# EAGLE schematic EnhancedMorseDecoder_Board (EAGLE 5.11)
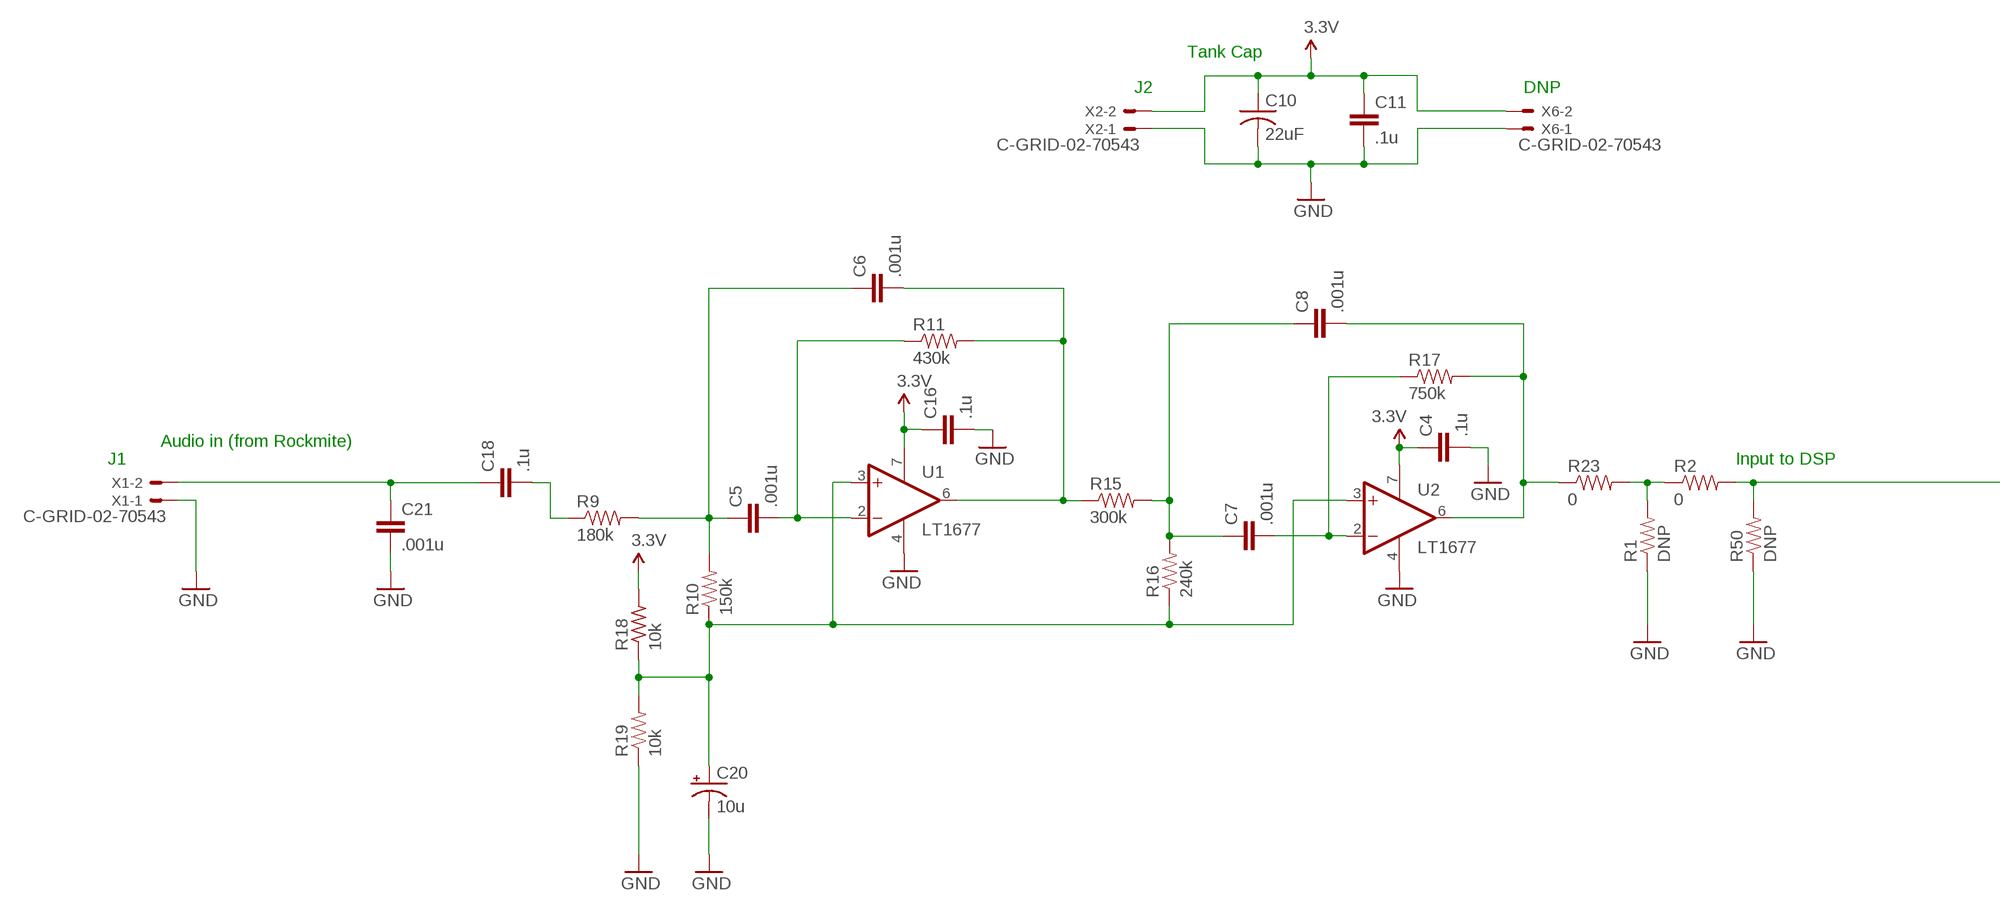
[diagram p0: schematic, sheet 1, part 1 of 2]
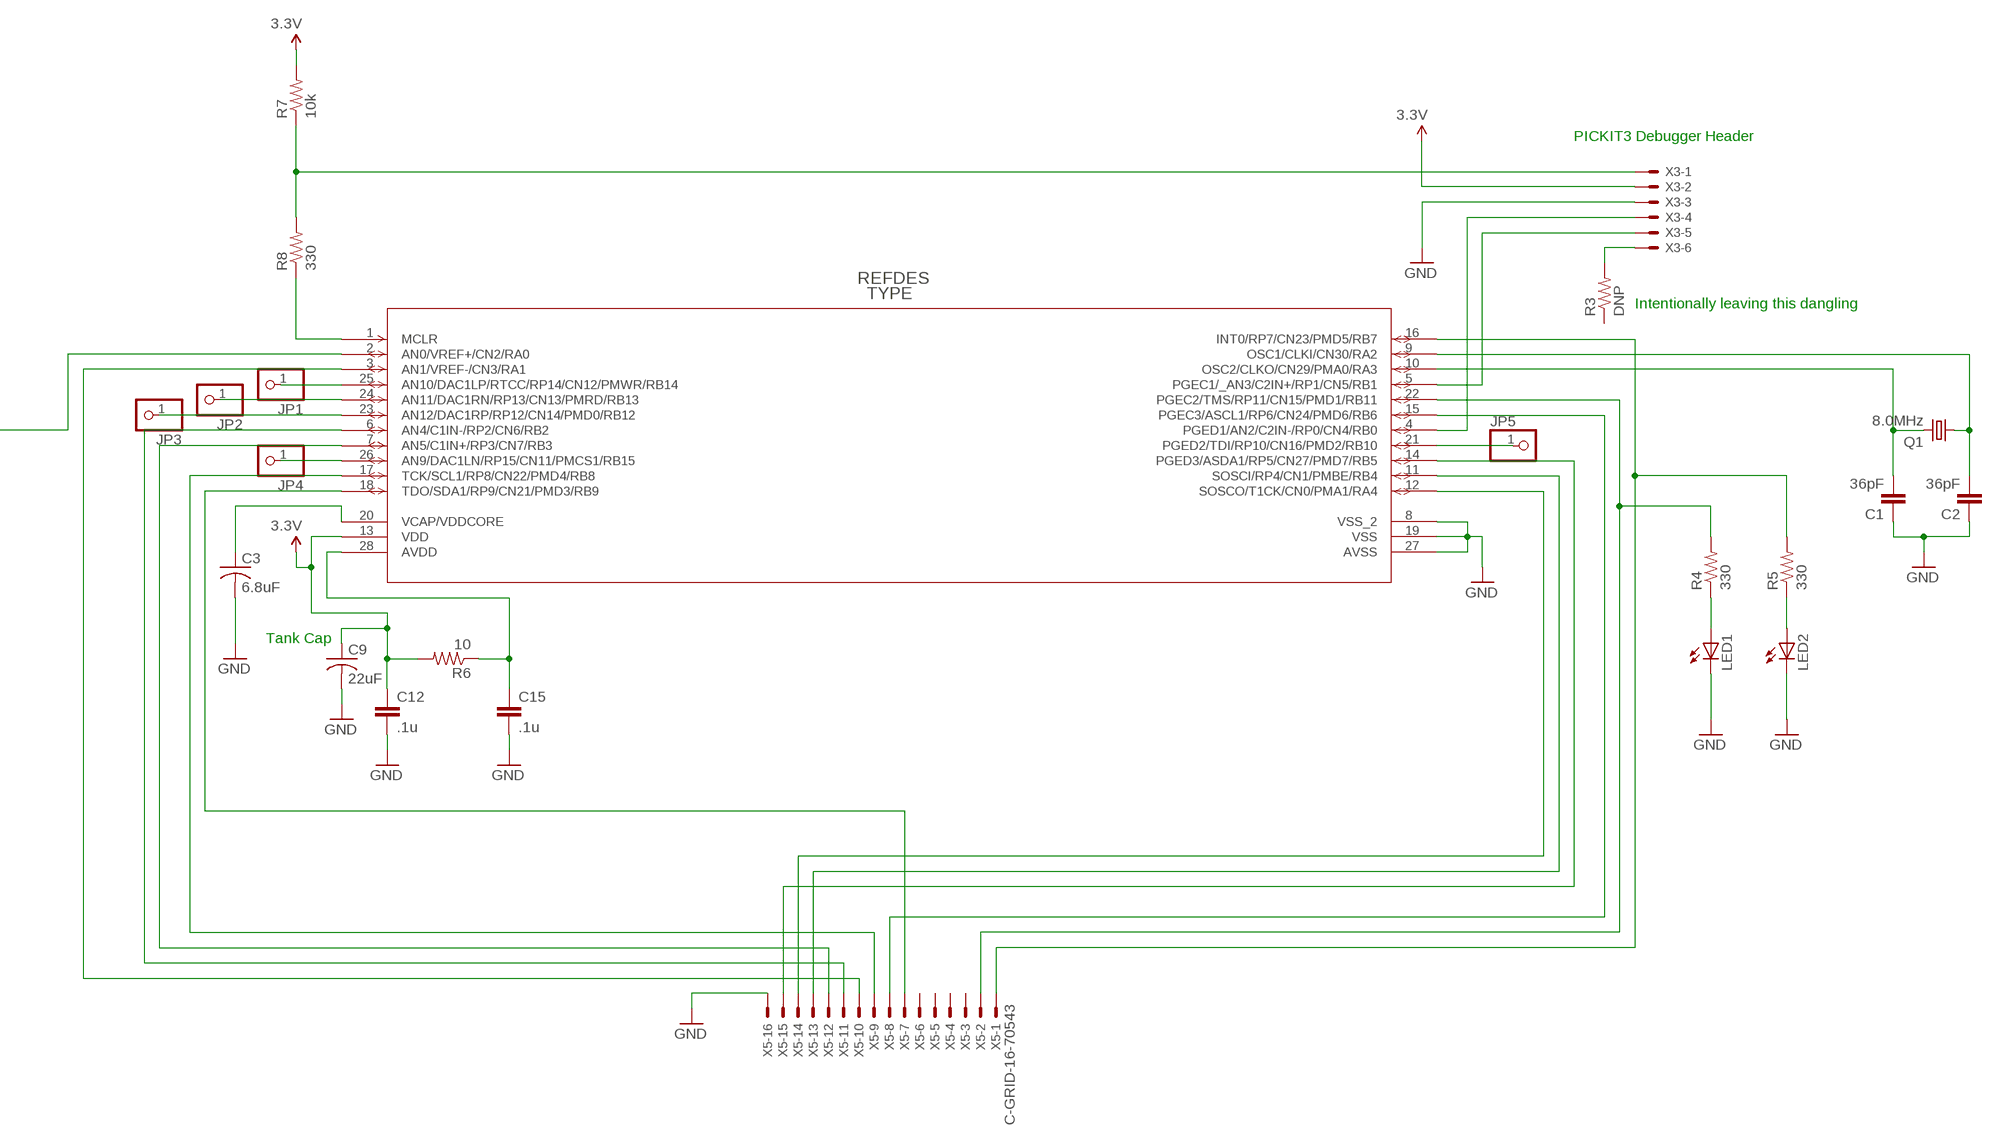
[diagram p1: schematic, sheet 1, part 2 of 2]

## Parts
C1  36pF  CAP0603-CAP  [0603-CAP]
C2  36pF  CAP0603-CAP  [0603-CAP]
C3  6.8uF  C-USC1206  [C1206]
C4  .1u  CAP1210  [1210]
C5  .001u  CAP0805  [0805]
C6  .001u  CAP0805  [0805]
C7  .001u  CAP0805  [0805]
C8  .001u  CAP0805  [0805]
C9  22uF  C-USC1210  [C1210]
C10  22uF  C-USC1210  [C1210]
C11  .1u  CAP1210  [1210]
C12  .1u  CAP1210  [1210]
C15  .1u  CAP1210  [1210]
C16  .1u  CAP1210  [1210]
C18  .1u  CAP1210  [1210]
C20  10u  CAP_POL7343  [EIA7343]
C21  .001u  CAP0805  [0805]
JP1  PINHD-1X1  [1X01]
JP2  PINHD-1X1  [1X01]
JP3  PINHD-1X1  [1X01]
JP4  PINHD-1X1  [1X01]
JP5  PINHD-1X1  [1X01]
LED1  LEDCHIPLED_0805  [CHIPLED_0805]
LED2  LEDCHIPLED_0805  [CHIPLED_0805]
Q1  8.0MHz  CRYSTALHC33U-V  [HC33U-V]
R1  DNP  RESISTOR  [0805]
R2  0  RESISTOR  [0805]
R3  DNP  RESISTOR  [0805]
R4  330  R-US_R0603  [R0603]
R5  330  R-US_R0603  [R0603]
R6  10  R-US_R0805  [R0805]
R7  10k  R-US_R0603  [R0603]
R8  330  R-US_R0603  [R0603]
R9  180k  RESISTOR  [0805]
R10  150k  RESISTOR1206  [1206]
R11  430k  RESISTOR1206  [1206]
R15  300k  RESISTOR1206  [1206]
R16  240k  RESISTOR1206  [1206]
R17  750k  RESISTOR1206  [1206]
R18  10k  R-US_R0603  [R0603]
R19  10k  RESISTOR0603-RES  [0603-RES]
R23  0  RESISTOR  [0805]
R50  DNP  RESISTOR  [0805]
U1  LT1677  LM307D  [SO08]
U2  LT1677  LM307D  [SO08]
U$5  DSPIC33FJ128GP80  [SOIC28_W_MC]
X1  C-GRID-02-70543  [70543-02]
X2  C-GRID-02-70543  [70543-02]
X3  22-23-2061  [22-23-2061]
X5  C-GRID-16-70543  [70543-16]
X6  C-GRID-02-70543  [70543-02]

## Nets
3.3V: C4.1 C9.1 C10.1 C11.1 C12.1 C16.1 R6.2 R7.2 R18.2 U1.7(V+) U2.7(V+) U$5.13(VDD) X2.2 X3.2 X6.2
GND: C1.1 C2.1 C3.2 C4.2 C9.2 C10.2 C11.2 C12.2 C15.2 C16.2 C20.C(-) C21.2 LED1.C LED2.C R1.1 R19.1 R50.1 U1.4(V-) U2.4(V-) U$5.8(VSS_2) U$5.19(VSS) U$5.27(AVSS) X1.1 X2.1 X3.3 X5.16 X6.1
N$1: R1.2 R2.1 R23.2
N$2: C1.2 Q1.2 U$5.10(OSC2/CLKO/CN29/PMA0/RA3)
N$3: C18.2 R9.1
N$4: C5.1 C6.1 R9.2 R10.2
N$5: C20.A(+) R10.1 R16.1 R18.1 R19.2 U1.3(+IN) U2.3(+IN)
N$6: JP1.1 U$5.25(AN10/DAC1LP/RTCC/RP14/CN12/PMWR/RB14)
N$7: C6.2 R11.2 R15.1 U1.6(OUT)
N$8: C18.1 C21.1 X1.2
N$9: C7.1 C8.1 R15.2 R16.2
N$10: C7.2 R17.1 U2.2(-IN)
N$11: C8.2 R17.2 R23.1 U2.6(OUT)
N$12: C15.1 R6.1 U$5.28(AVDD)
N$13: U$5.3(AN1/VREF-/CN3/RA1) X5.10
N$14: R2.2 R50.2 U$5.2(AN0/VREF+/CN2/RA0)
N$15: C5.2 R11.1 U1.2(-IN)
N$16: U$5.4(PGED1/AN2/C2IN-/RP0/CN4/RB0) X3.4
N$17: U$5.5(PGEC1/_AN3/C2IN+/RP1/CN5/RB1) X3.5
N$18: R3.2 X3.6
N$19: JP2.1 U$5.24(AN11/DAC1RN/RP13/CN13/PMRD/RB13)
N$20: JP3.1 U$5.23(AN12/DAC1RP/RP12/CN14/PMD0/RB12)
N$21: JP4.1 U$5.26(AN9/DAC1LN/RP15/CN11/PMCS1/RB15)
N$22: C2.2 Q1.1 U$5.9(OSC1/CLKI/CN30/RA2)
N$23: JP5.1 U$5.21(PGED2/TDI/RP10/CN16/PMD2/RB10)
N$26: U$5.17(TCK/SCL1/RP8/CN22/PMD4/RB8) X5.9
N$27: U$5.18(TDO/SDA1/RP9/CN21/PMD3/RB9) X5.7
N$28: R5.2 U$5.16(INT0/RP7/CN23/PMD5/RB7) X5.1
N$29: R4.2 U$5.22(PGEC2/TMS/RP11/CN15/PMD1/RB11) X5.2
N$30: U$5.15(PGEC3/ASCL1/RP6/CN24/PMD6/RB6) X5.8
N$32: U$5.14(PGED3/ASDA1/RP5/CN27/PMD7/RB5) X5.15
N$33: U$5.11(SOSCI/RP4/CN1/PMBE/RB4) X5.13
N$34: R8.1 U$5.1(MCLR)
N$35: LED1.A R4.1
N$37: LED2.A R5.1
N$38: U$5.12(SOSCO/T1CK/CN0/PMA1/RA4) X5.14
N$39: C3.1 U$5.20(VCAP/VDDCORE)
N$40: R7.1 R8.2 X3.1
N$41: U$5.6(AN4/C1IN-/RP2/CN6/RB2) X5.11
N$42: U$5.7(AN5/C1IN+/RP3/CN7/RB3) X5.12
Unconnected: R3.1 X5.3 X5.4 X5.5 X5.6

## Notes on the sheet
- Tank Cap
- J2 | DNP
- PICKIT3 Debugger Header
- Intentionally leaving this dangling
- Audio in (from Rockmite)
- J1 | Input to DSP
- Tank Cap

## Library data of the parts
C1 C2 C4-C8 C11 C12 C15 C16 C18 C21 = SparkFun:CAP: Capacitor Standard 0603 ceramic capacitor, and 0.1" leaded capacitor.
C3 C9 C10 = rcl:C-US: CAPACITOR, American symbol
C20 = SparkFun:CAP_POL: Capacitor Polarized These are standard SMD and PTH capacitors. Normally 10uF, 47uF, and 100uF in electrolytic and tantalum varieties. Always verify the external diameter of the through hole cap, it varies with capacity, voltage, and manufacturer. The EIA devices should be standard.
JP1-JP5 = pinhead:PINHD-1X1: PIN HEADER
LED1 LED2 = led:LED: LED OSRAM: - CHIPLED LG R971, LG N971, LY N971, LG Q971, LY Q971, LO R971, LY R971 LH N974, LH R974 LS Q976, LO Q976, LY Q976 LO Q996 - Hyper CHIPLED LW Q18S LB Q993, LB Q99A, LB R99A - SideLED LS A670, LO A670, LY A670, LG A670, LP A670 LB A673, LV A673, LT A673, LW A673 LH A674 LY A675 LS A676, LA A676, LO A676, LY A676, LW A676 LS A679, LY A679, LG A679 - Hyper Micro SIDELED® LS Y876, LA Y876, LO Y876, LY Y876 LT Y87S - SmartLED LW L88C, LW L88S LB L89C, LB L89S, LG L890 LS L89K, LO L89K, LY L89K LS L896, LA L896, LO L896, LY L896 - TOPLED LS T670, LO T670, LY T670, LG T670, LP T670 LSG T670, LSP T670, LSY T670, LOP T670, LYG T670 LG T671, LOG T671, LSG T671 LB T673, LV T673, LT T673, LW T673 LH T674 LS T676, LA T676, LO T676, LY T676, LB T676, LH T676, LSB T676, LW T676 LB T67C, LV T67C, LT T67C, LS T67K, LO T67K, LY T67K, LW E67C LS E67B, LA E67B, LO E67B, LY E67B, LB E67C, LV E67C, LT E67C LW T67C LS T679, LY T679, LG T679 LS T770, LO T770, LY T770, LG T770, LP T770 LB T773, LV T773, LT T773, LW T773 LH T774 LS E675, LA E675, LY E675, LS T675 LS T776, LA T776, LO T776, LY T776, LB T776 LHGB T686 LT T68C, LB T68C - Hyper Mini TOPLED® LB M676 - Mini TOPLED Santana® LG M470 LS M47K, LO M47K, LY M47K Source: http://www.osram.convergy.de LUXEON: - LUMILED® LXK2-PW12-R00, LXK2-PW12-S00, LXK2-PW14-U00, LXK2-PW14-V00 LXK2-PM12-R00, LXK2-PM12-S00, LXK2-PM14-U00 LXK2-PE12-Q00, LXK2-PE12-R00, LXK2-PE12-S00, LXK2-PE14-T00, LXK2-PE14-U00 LXK2-PB12-K00, LXK2-PB12-L00, LXK2-PB12-M00, LXK2-PB14-N00, LXK2-PB14-P00, LXK2-PB14-Q00 LXK2-PR12-L00, LXK2-PR12-M00, LXK2-PR14-Q00, LXK2-PR14-R00 LXK2-PD12-Q00, LXK2-PD12-R00, LXK2-PD12-S00 LXK2-PH12-R00, LXK2-PH12-S00 LXK2-PL12-P00, LXK2-PL12-Q00, LXK2-PL12-R00 Source: www.luxeon.com KINGBRIGHT: KA-3528ASYC Source: www.kingbright.com
Q1 = crystal:CRYSTAL: CRYSTAL; OC_FARNELL: unknown; OC_NEWARK: unknown
R1-R3 R9-R11 R15-R17 R19 R23 R50 = SparkFun:RESISTOR: Resistor Basic schematic elements and footprints for 0603, 1206, and PTH 1/10th watt (small) resistors.
R4-R8 R18 = rcl:R-US_: RESISTOR, American symbol
U1 U2 = linear:LM307: OP AMP
U$5 = DSPIC33FJ128GPS80:DSPIC33FJ128GP80
X1 X2 X6 = con-molex:C-GRID-02: CONNECTOR wire to board 2.54 mm (0.100") pitch header; OC_FARNELL: unknown; OC_NEWARK: unknown
X3 = con-molex:22-23-2061: .100" (2.54mm) Center Header - 6 Pin; MF: MOLEX; MPN: 22-23-2061; OC_FARNELL: 1462922; OC_NEWARK: 27C1933
X5 = con-molex:C-GRID-16: CONNECTOR wire to board 2.54 mm (0.100") pitch header; OC_FARNELL: unknown; OC_NEWARK: unknown